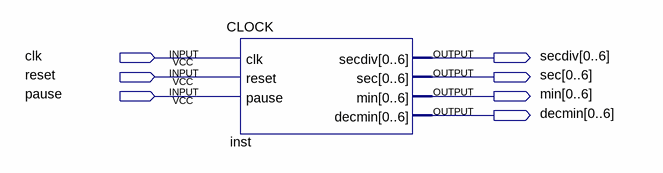
[diagram p0: schematic sheet]
// Quartus schematic CLK.bdf as structural Verilog: 1 symbols, 7 pins
module CLK (
  input  clk,
  input  reset,
  input  pause,
  output [0:6] secdiv,
  output [0:6] sec,
  output [0:6] min,
  output [0:6] decmin
);

  CLOCK inst (.clk(clk), .reset(reset), .pause(pause), .secdiv(secdiv), .sec(sec), .min(min), .decmin(decmin));
endmodule
